# Altium schematic sheet Bucks.SchDoc
size A4; SheetNumber: 2; SheetTotal: 5
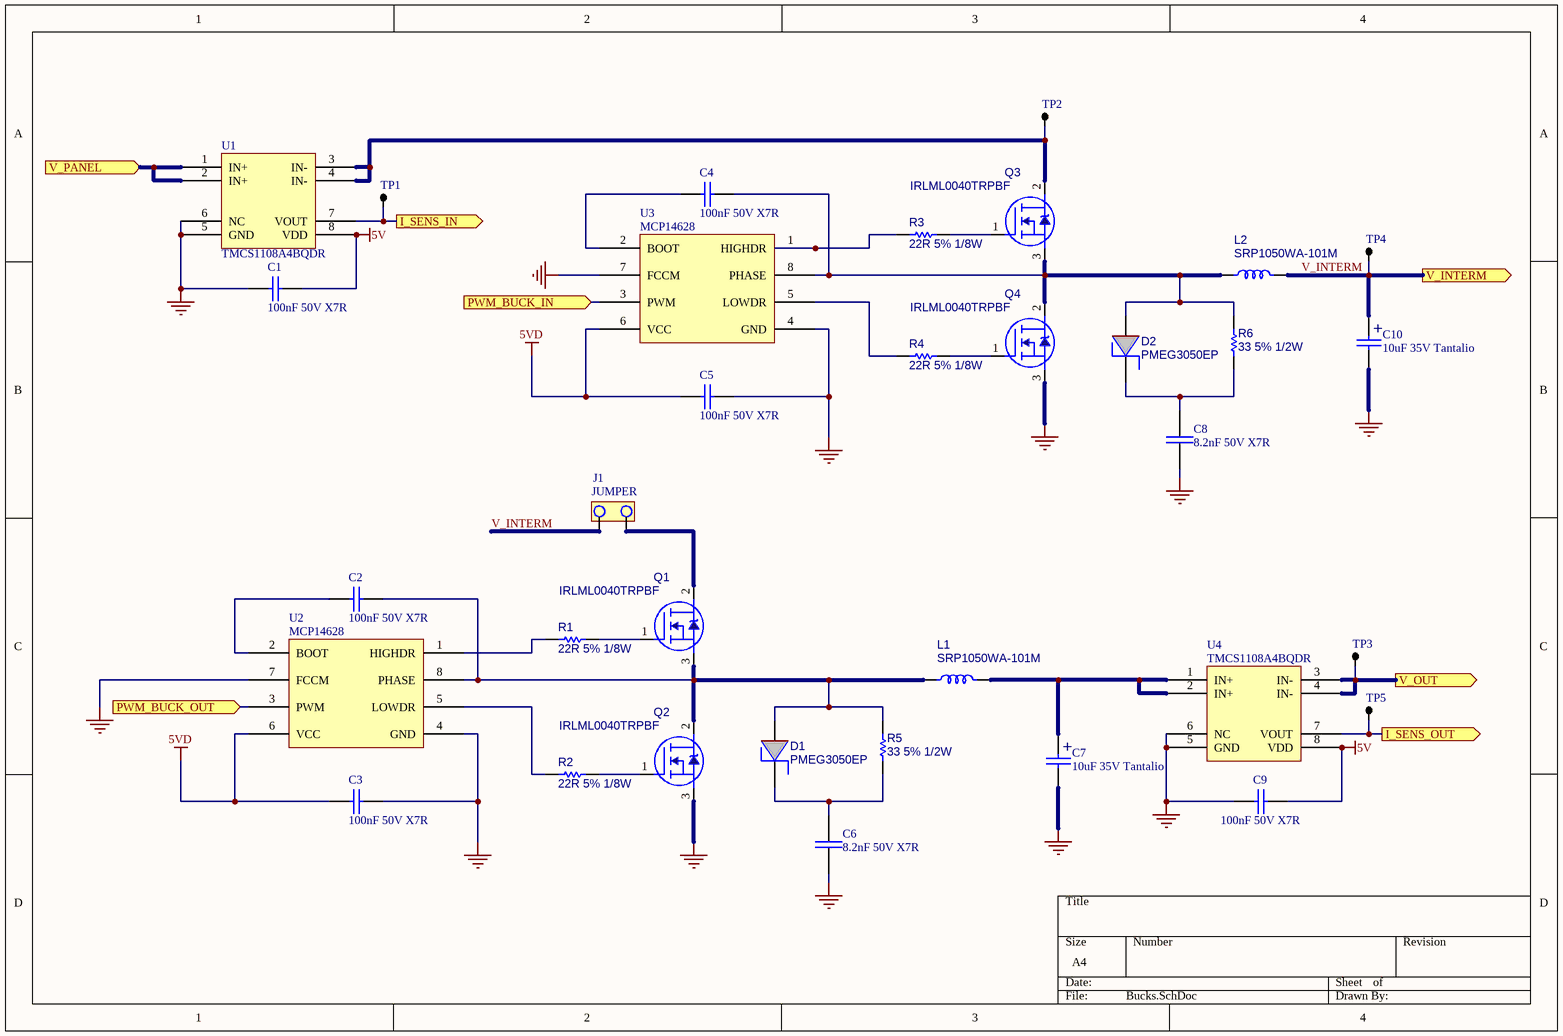
[diagram p0: Bucks.SchDoc]

## Parts
C1  100nF 50V X7R  [0805]
C2  100nF 50V X7R  [0805]
C3  100nF 50V X7R  [0805]
C4  100nF 50V X7R  [0805]
C5  100nF 50V X7R  [0805]
C6  8.2nF 50V X7R  [0805]
C7  10uF 35V Tantalio  [CAPPOL1210]
C8  8.2nF 50V X7R  [0805]
C9  100nF 50V X7R  [0805]
C10  10uF 35V Tantalio  [CAPPOL1210]
D1  PMEG3050EP  [SOD-128]
D2  PMEG3050EP  [SOD-128]
J1  JUMPER  [0805]
L1  SRP1050WA-101M  [SRP1050WA]
L2  SRP1050WA-101M  [SRP1050WA]
Q1  IRLML0040TRPBF  [DPAK]
Q2  IRLML0040TRPBF  [DPAK]
Q3  IRLML0040TRPBF  [DPAK]
Q4  IRLML0040TRPBF  [DPAK]
R1  22R 5% 1/8W  [0805]
R2  22R 5% 1/8W  [0805]
R3  22R 5% 1/8W  [0805]
R4  22R 5% 1/8W  [0805]
R5  33 5% 1/2W  [1206]
R6  33 5% 1/2W  [1206]
TP1  TP  [TP_COMPACT]  (value not drawn)
TP2  TP  [TP_COMPACT]  (value not drawn)
TP3  TP  [TP_COMPACT]  (value not drawn)
TP4  TP  [TP_COMPACT]  (value not drawn)
TP5  TP  [TP_COMPACT]  (value not drawn)
U1  TMCS1108A4BQDR  [SO8]
U2  MCP14628  [SO8]
U3  MCP14628  [SO8]
U4  TMCS1108A4BQDR  [SO8]

## Ports
I_SENS_IN (out, see MainSCH[4C], Filtros[1B]), I_SENS_OUT (out, see MainSCH[4C], Filtros[1C]), PWM_BUCK_IN (in, see MainSCH[3C], Microcontrolador[4A]), PWM_BUCK_OUT (in, see MainSCH[3C], Microcontrolador[4B]), V_INTERM (out, see MainSCH[4C], Filtros[2C]), V_OUT (out, see MainSCH[4C], Filtros[3B]), V_PANEL (in, see MainSCH[3C], Filtros[2A], Fuentes[1B])

## Nets
5V: C1.1 C9.1 U1.8(VDD) U4.8(VDD)
5VD: C3.2 C5.2 U2.6(VCC) U3.6(VCC)
GND: C1.2 C3.1 C5.1 C6.2 C7.2 C8.2 C9.2 C10.2 Q2.3(SOURCE) Q4.3(SOURCE) U1.5(GND) U1.6(NC) U2.4(GND) U2.7(FCCM) U3.4(GND) U3.7(FCCM) U4.5(GND) U4.6(NC)
I_SENS_IN: TP1.1 U1.7(VOUT) ; port I_SENS_IN
I_SENS_OUT: TP5.1 U4.7(VOUT) ; port I_SENS_OUT
PWM_BUCK_IN: U3.3(PWM) ; port PWM_BUCK_IN
PWM_BUCK_OUT: U2.3(PWM) ; port PWM_BUCK_OUT
V_INTERM: C10.1 J1.2 L2.2 TP4.1 ; port V_INTERM
V_OUT: TP3.1 U4.3(IN-) U4.4(IN-) ; port V_OUT
V_PANEL: U1.1(IN+) U1.2(IN+) ; port V_PANEL
NetC2_1: C2.1 D1.1(A) L1.1 Q1.3(SOURCE) Q2.2(DRAIN) R5.2 U2.8(PHASE)
NetC2_2: C2.2 U2.2(BOOT)
NetC4_1: C4.1 D2.1(A) L2.1 Q3.3(SOURCE) Q4.2(DRAIN) R6.2 U3.8(PHASE)
NetC4_2: C4.2 U3.2(BOOT)
NetC6_1: C6.1 D1.2(K) R5.1
NetC7_1: C7.1 L1.2 U4.1(IN+) U4.2(IN+)
NetC8_1: C8.1 D2.2(K) R6.1
NetJ1_1: J1.1 Q1.2(DRAIN)
NetQ1_1: Q1.1(GATE) R1.1
NetQ2_1: Q2.1(GATE) R2.1
NetQ3_1: Q3.1(GATE) R3.1
NetQ3_2: Q3.2(DRAIN) TP2.1 U1.3(IN-) U1.4(IN-)
NetQ4_1: Q4.1(GATE) R4.1
NetR1_2: R1.2 U2.1(HIGHDR)
NetR2_2: R2.2 U2.5(LOWDR)
NetR3_2: R3.2 U3.1(HIGHDR)
NetR4_2: R4.2 U3.5(LOWDR)

## Notes on the sheet
- (in symbol CAPPOL) +

## Library data of the parts
C1-C5 C9 = CAP
C6 C8 = Ceramic capacitor
C7 C10 = CAPPOL: TCJB106M035R0200
D1 D2 = DIODO_SH: Diode Shottky
L1 L2 = IND: Inductor
Q1-Q4 = N_MOSFET_SOT23: Mosfet N-Ch
R1-R6 = Res1: Resistor
U1 U4 = TMCS1108: Supplier 1: Digi-Key; Supplier Part Number 1: 296-TMCS1108A4BQDRCT-ND